# Altium schematic sheet WiFiShield.SchDoc
size A4
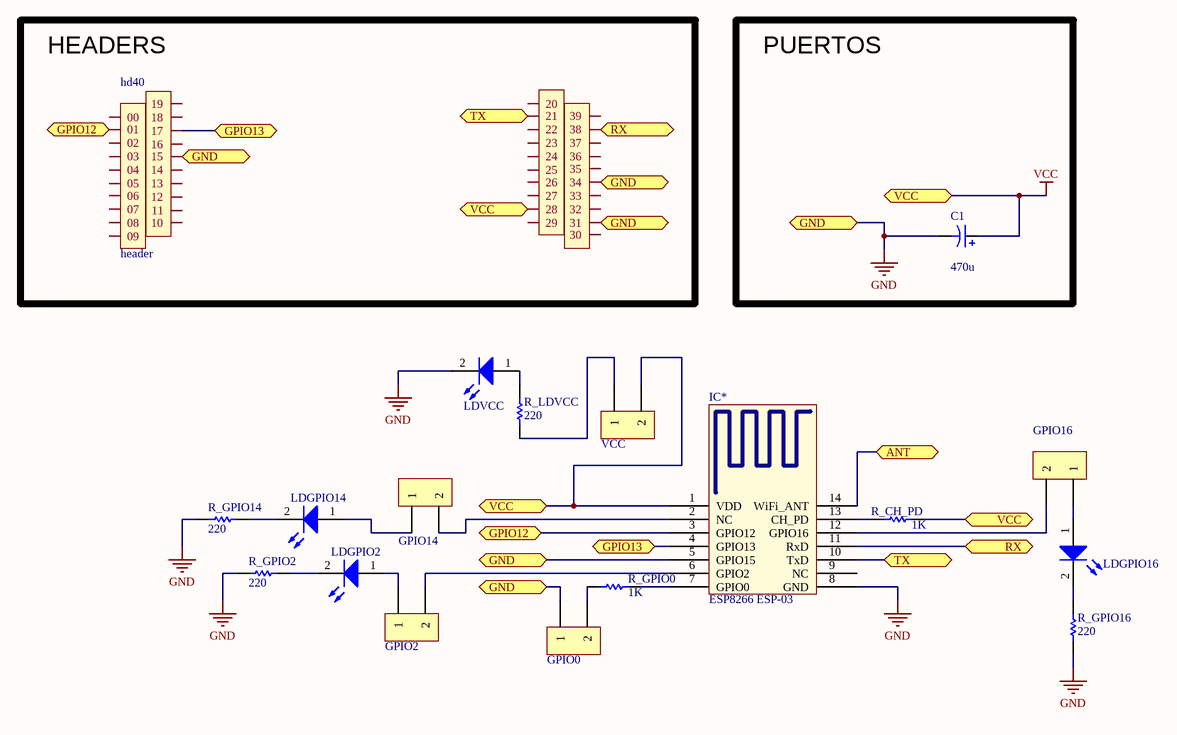
[diagram p0: WiFiShield.SchDoc]

## Parts
C1  value 470u  [CAP POL 6.3x11 Pitch 2.5mm]  (hidden comment: Cap Pol)
GPIO0  Header-1x2  [HEADER-1x2]  (value not drawn)
GPIO2  Header-1x2  [HEADER-1x2]  (value not drawn)
GPIO14  Header-1x2  [HEADER-1x2]  (value not drawn)
GPIO16  Header-1x2  [HEADER-1x2]  (value not drawn)
hd40  header  [header_cognitiveNGD]
IC*  ESP8266 ESP-03  [ESP8266 ESP-03]
LDGPIO2  LED  [0603 LED-BLUE]  (value not drawn)
LDGPIO14  LED  [0603 LED-BLUE]  (value not drawn)
LDGPIO16  LED  [0603 LED-Green]  (value not drawn)
LDVCC  LED  [0603 LED-RED]  (value not drawn)
R_CH_PD  value 1K  [0603 Res]  (hidden comment: Res)
R_GPIO0  value 1K  [0603 Res]  (hidden comment: Res)
R_GPIO2  value 220  [0603 Res]  (hidden comment: Res)
R_GPIO14  value 220  [0603 Res]  (hidden comment: Res)
R_GPIO16  value 220  [0603 Res]  (hidden comment: Res)
R_LDVCC  value 220  [0603 Res]  (hidden comment: Res)
VCC  Header-1x2  [HEADER-1x2]  (value not drawn)

## Blocks framed on the sheet
HEADERS: hd40
PUERTOS: C1

## Ports
ANT, GND, GPIO12, GPIO13, RX, TX, VCC

## Nets
GND: C1.2 GPIO0.1 hd40.15 hd40.31 hd40.34 IC*.5(GPIO15) IC*.8(GND) LDVCC.2(C) R_GPIO2.2 R_GPIO14.2 R_GPIO16.2 ; port GND
VCC: C1.1 hd40.28 IC*.1(VDD) R_CH_PD.1 VCC.2 ; port VCC
ANT: IC*.14(WiFi_ANT) ; port ANT
GPIO12: hd40.01 IC*.3(GPIO12) ; port GPIO12
GPIO13: hd40.17 IC*.4(GPIO13) ; port GPIO13
RX: hd40.38 IC*.11(RxD) ; port RX
TX: hd40.21 IC*.10(TxD) ; port TX
NetGPIO0_2: GPIO0.2 R_GPIO0.1
NetGPIO2_1: GPIO2.1 LDGPIO2.1(A)
NetGPIO2_2: GPIO2.2 IC*.6(GPIO2)
NetGPIO14_1: GPIO14.1 LDGPIO14.1(A)
NetGPIO14_2: GPIO14.2 IC*.2(NC)
NetGPIO16_1: GPIO16.1 LDGPIO16.1(A)
NetGPIO16_2: GPIO16.2 IC*.12(GPIO16)
NetIC*_7: IC*.7(GPIO0) R_GPIO0.2
NetIC*_13: IC*.13(CH_PD) R_CH_PD.2
NetLDGPIO2_2: LDGPIO2.2(C) R_GPIO2.1
NetLDGPIO14_2: LDGPIO14.2(C) R_GPIO14.1
NetLDGPIO16_2: LDGPIO16.2(C) R_GPIO16.1
NetLDVCC_1: LDVCC.1(A) R_LDVCC.1
NetR_LDVCC_2: R_LDVCC.2 VCC.1

Not connected (* = marked no-connect by the designer): hd40 00 02 03 04 05 06 07 08 09 10 11 12 13 14 16 18 19 20 22 23 24 25 26 27 29 30 32 33 35 36 37 39; IC* 9(NC)

## Library data of the parts
hd40 = header_cognitiveNGD